# Altium schematic sheet Disconnects.SchDoc
size Tabloid; DocumentNumber: 2; SheetNumber: 2; SheetTotal: 2
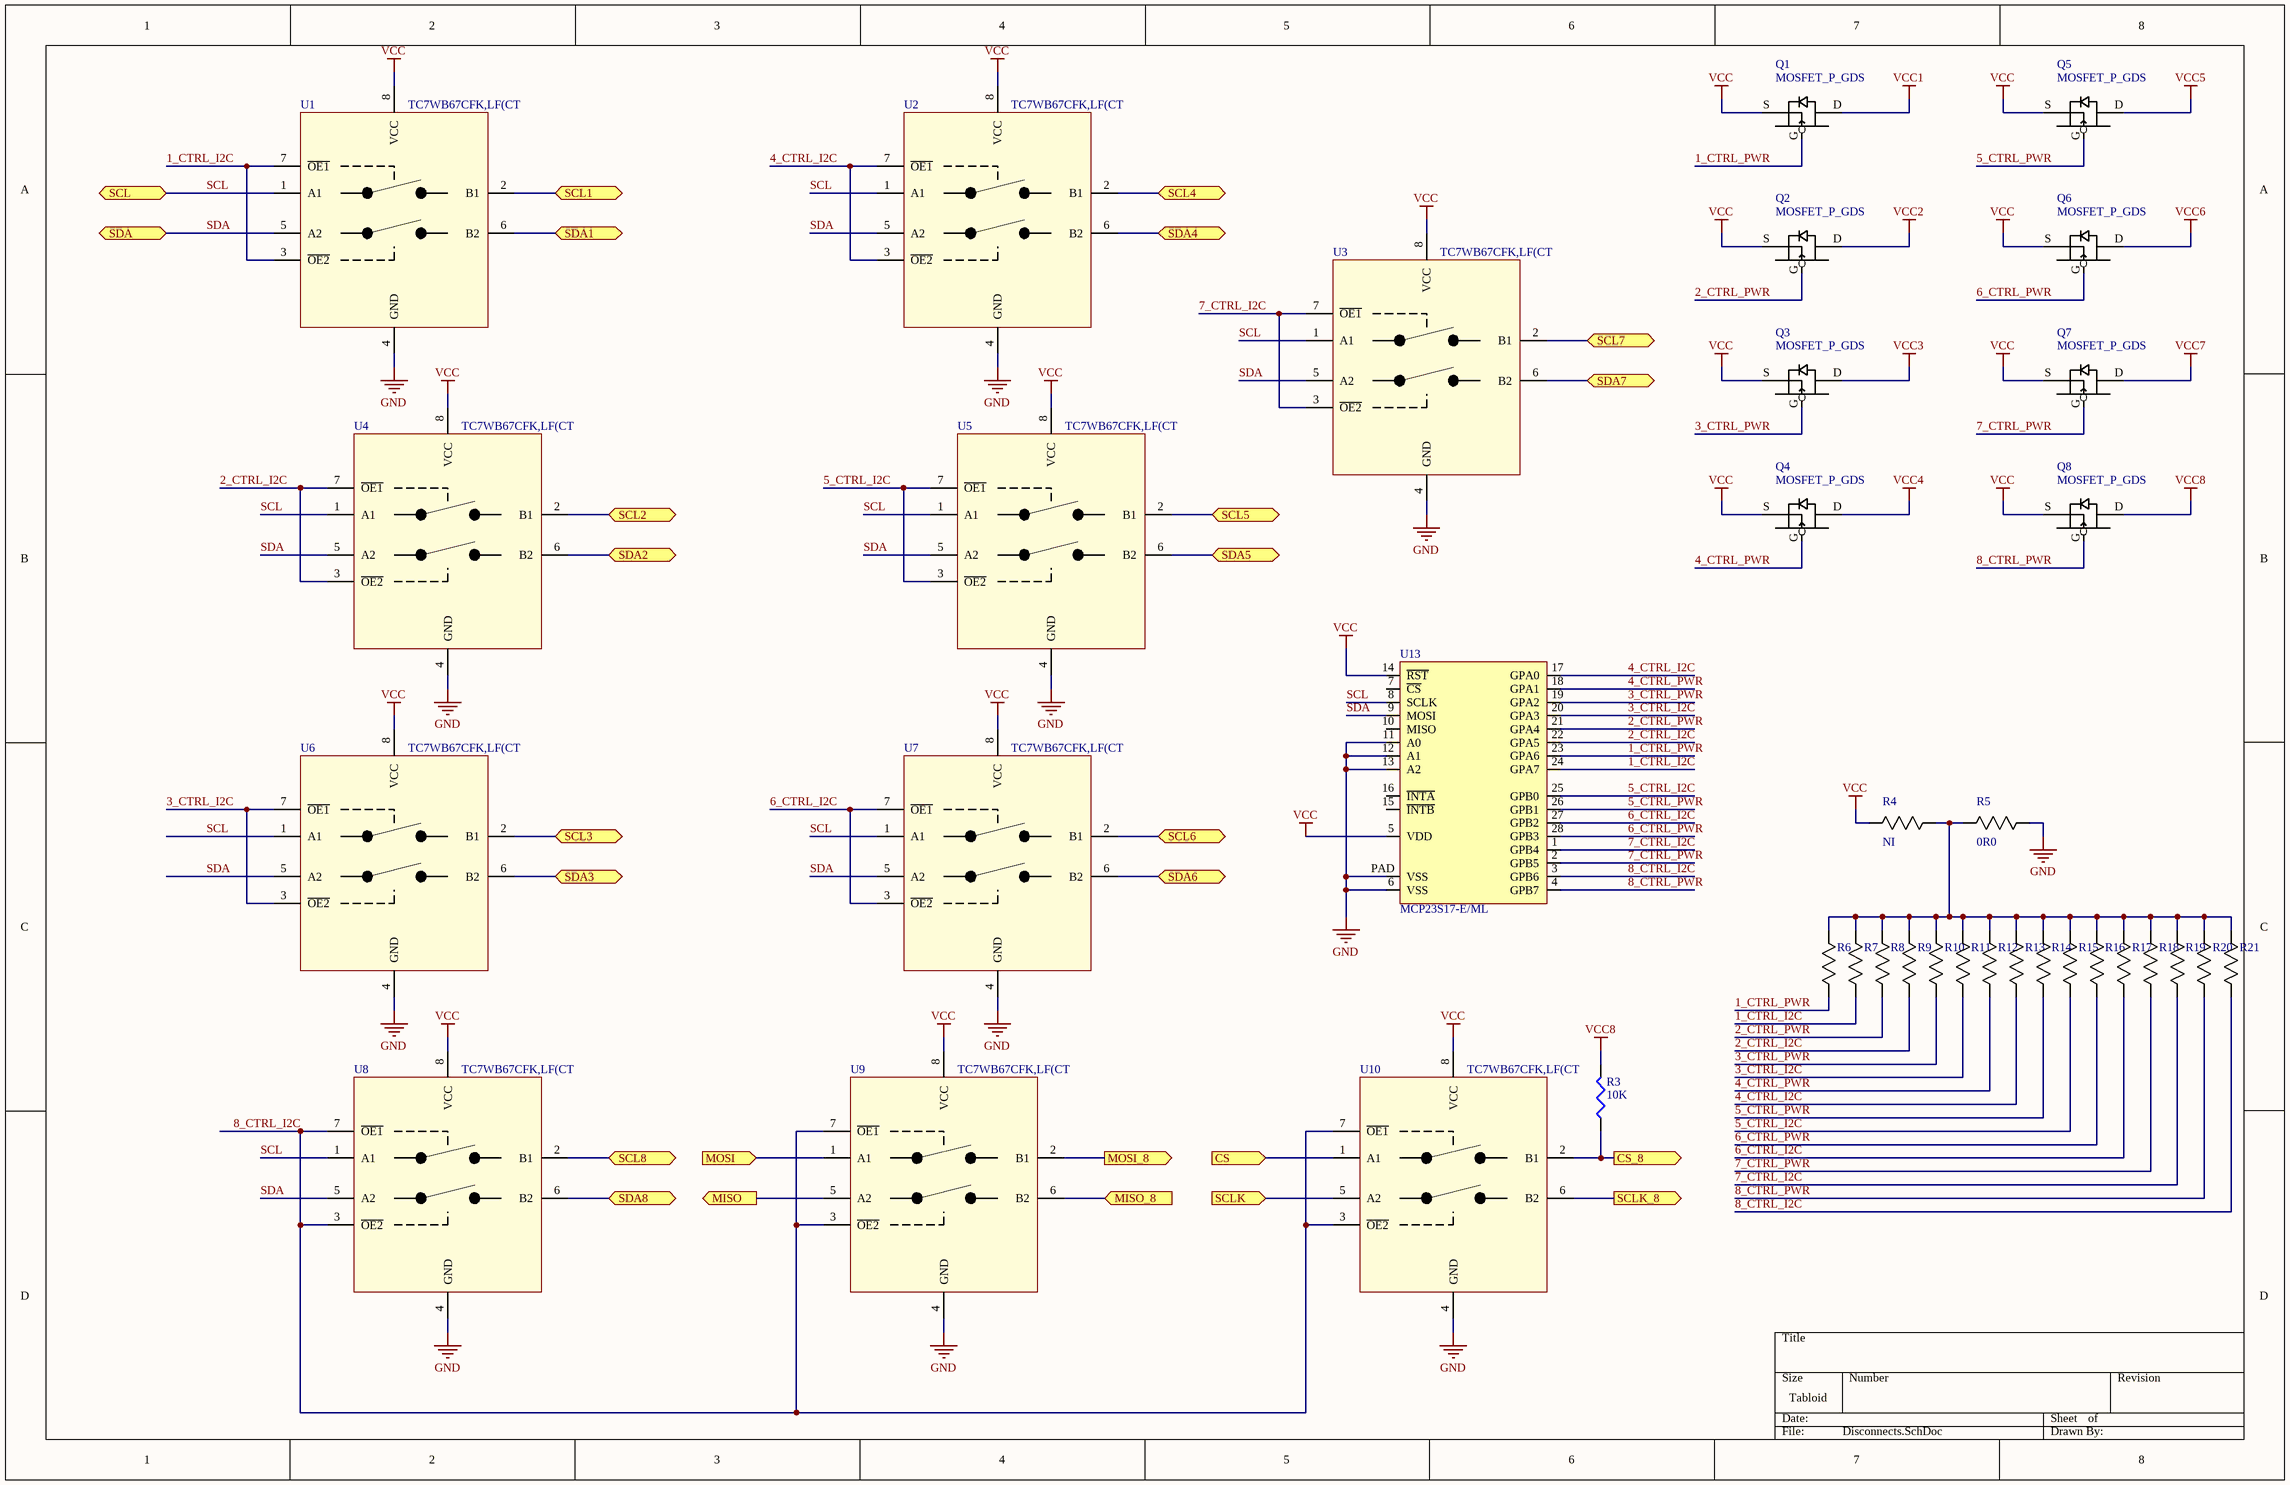
[diagram p0: Disconnects.SchDoc]

## Parts
Q1  MOSFET_P_GDS  [SC70_GDS]
Q2  MOSFET_P_GDS  [SC70_GDS]
Q3  MOSFET_P_GDS  [SC70_GDS]
Q4  MOSFET_P_GDS  [SC70_GDS]
Q5  MOSFET_P_GDS  [SC70_GDS]
Q6  MOSFET_P_GDS  [SC70_GDS]
Q7  MOSFET_P_GDS  [SC70_GDS]
Q8  MOSFET_P_GDS  [SC70_GDS]
R3  value 10K  [6-0805_N]  (hidden comment: Res 10K)
R4  Resistor  [0603]  (value not drawn)
R5  value 0R0  [0603]  (hidden comment: Resistor)
R6  Resistor  [0603]  (value not drawn)
R7  Resistor  [0603]  (value not drawn)
R8  Resistor  [0603]  (value not drawn)
R9  Resistor  [0603]  (value not drawn)
R10  Resistor  [0603]  (value not drawn)
R11  Resistor  [0603]  (value not drawn)
R12  Resistor  [0603]  (value not drawn)
R13  Resistor  [0603]  (value not drawn)
R14  Resistor  [0603]  (value not drawn)
R15  Resistor  [0603]  (value not drawn)
R16  Resistor  [0603]  (value not drawn)
R17  Resistor  [0603]  (value not drawn)
R18  Resistor  [0603]  (value not drawn)
R19  Resistor  [0603]  (value not drawn)
R20  Resistor  [0603]  (value not drawn)
R21  Resistor  [0603]  (value not drawn)
U1  Mfg_PN: TC7WB67CFK,LF(CT  [PSOP8]  (hidden comment: TC7WB67CFK,LF)
U2  Mfg_PN: TC7WB67CFK,LF(CT  [PSOP8]  (hidden comment: TC7WB67CFK,LF)
U3  Mfg_PN: TC7WB67CFK,LF(CT  [PSOP8]  (hidden comment: TC7WB67CFK,LF)
U4  Mfg_PN: TC7WB67CFK,LF(CT  [PSOP8]  (hidden comment: TC7WB67CFK,LF)
U5  Mfg_PN: TC7WB67CFK,LF(CT  [PSOP8]  (hidden comment: TC7WB67CFK,LF)
U6  Mfg_PN: TC7WB67CFK,LF(CT  [PSOP8]  (hidden comment: TC7WB67CFK,LF)
U7  Mfg_PN: TC7WB67CFK,LF(CT  [PSOP8]  (hidden comment: TC7WB67CFK,LF)
U8  Mfg_PN: TC7WB67CFK,LF(CT  [PSOP8]  (hidden comment: TC7WB67CFK,LF)
U9  Mfg_PN: TC7WB67CFK,LF(CT  [PSOP8]  (hidden comment: TC7WB67CFK,LF)
U10  Mfg_PN: TC7WB67CFK,LF(CT  [PSOP8]  (hidden comment: TC7WB67CFK,LF)
U13  MCP23S17-E/ML  [QFN28-S]

## Ports
CS (in), CS_8 (out), MISO (out), MISO_8 (in), MOSI (in), MOSI_8 (out), SCL1 (bidir), SCL2 (bidir), SCL3 (bidir), SCL4 (bidir), SCL5 (bidir), SCL6 (bidir), SCL7 (bidir), SCL8 (bidir), SCL (bidir), SCLK (in), SCLK_8 (out), SDA1 (bidir), SDA2 (bidir), SDA3 (bidir), SDA4 (bidir), SDA5 (bidir), SDA6 (bidir), SDA7 (bidir), SDA8 (bidir), SDA (bidir)

## Nets
GND: R5.2 U1.4(GND) U2.4(GND) U3.4(GND) U4.4(GND) U5.4(GND) U6.4(GND) U7.4(GND) U8.4(GND) U9.4(GND) U10.4(GND) U13.6(VSS) U13.11(A0) U13.12(A1) U13.13(A2) U13.PAD(VSS)
VCC: Q1.S Q2.S Q3.S Q4.S Q5.S Q6.S Q7.S Q8.S R4.1 U1.8(VCC) U2.8(VCC) U3.8(VCC) U4.8(VCC) U5.8(VCC) U6.8(VCC) U7.8(VCC) U8.8(VCC) U9.8(VCC) U10.8(VCC) U13.5(VDD) U13.14(~{RST})
VCC1: Q1.D
VCC2: Q2.D
VCC3: Q3.D
VCC4: Q4.D
VCC5: Q5.D
VCC6: Q6.D
VCC7: Q7.D
VCC8: Q8.D R3.2
1_CTRL_I2C: R7.2 U1.3(~{OE2}) U1.7(~{OE1}) U13.24(GPA7)
1_CTRL_PWR: Q1.G R6.2 U13.23(GPA6)
2_CTRL_I2C: R9.2 U4.3(~{OE2}) U4.7(~{OE1}) U13.22(GPA5)
2_CTRL_PWR: Q2.G R8.2 U13.21(GPA4)
3_CTRL_I2C: R11.2 U6.3(~{OE2}) U6.7(~{OE1}) U13.20(GPA3)
3_CTRL_PWR: Q3.G R10.2 U13.19(GPA2)
4_CTRL_I2C: R13.2 U2.3(~{OE2}) U2.7(~{OE1}) U13.17(GPA0)
4_CTRL_PWR: Q4.G R12.2 U13.18(GPA1)
5_CTRL_I2C: R15.2 U5.3(~{OE2}) U5.7(~{OE1}) U13.25(GPB0)
5_CTRL_PWR: Q5.G R14.2 U13.26(GPB1)
6_CTRL_I2C: R17.2 U7.3(~{OE2}) U7.7(~{OE1}) U13.27(GPB2)
6_CTRL_PWR: Q6.G R16.2 U13.28(GPB3)
7_CTRL_I2C: R19.2 U3.3(~{OE2}) U3.7(~{OE1}) U13.1(GPB4)
7_CTRL_PWR: Q7.G R18.2 U13.2(GPB5)
8_CTRL_I2C: R21.2 U8.3(~{OE2}) U8.7(~{OE1}) U9.3(~{OE2}) U9.7(~{OE1}) U10.3(~{OE2}) U10.7(~{OE1}) U13.3(GPB6)
8_CTRL_PWR: Q8.G R20.2 U13.4(GPB7)
CS: U10.1(A1) ; port CS
CS_8: R3.1 U10.2(B1) ; port CS_8
MISO: U9.5(A2) ; port MISO
MISO_8: U9.6(B2) ; port MISO_8
MOSI: U9.1(A1) ; port MOSI
MOSI_8: U9.2(B1) ; port MOSI_8
SCL: U1.1(A1) U2.1(A1) U3.1(A1) U4.1(A1) U5.1(A1) U6.1(A1) U7.1(A1) U8.1(A1) U13.8(SCLK) ; port SCL
SCL1: U1.2(B1) ; port SCL1
SCL2: U4.2(B1) ; port SCL2
SCL3: U6.2(B1) ; port SCL3
SCL4: U2.2(B1) ; port SCL4
SCL5: U5.2(B1) ; port SCL5
SCL6: U7.2(B1) ; port SCL6
SCL7: U3.2(B1) ; port SCL7
SCL8: U8.2(B1) ; port SCL8
SCLK: U10.5(A2) ; port SCLK
SCLK_8: U10.6(B2) ; port SCLK_8
SDA: U1.5(A2) U2.5(A2) U3.5(A2) U4.5(A2) U5.5(A2) U6.5(A2) U7.5(A2) U8.5(A2) U13.9(MOSI) ; port SDA
SDA1: U1.6(B2) ; port SDA1
SDA2: U4.6(B2) ; port SDA2
SDA3: U6.6(B2) ; port SDA3
SDA4: U2.6(B2) ; port SDA4
SDA5: U5.6(B2) ; port SDA5
SDA6: U7.6(B2) ; port SDA6
SDA7: U3.6(B2) ; port SDA7
SDA8: U8.6(B2) ; port SDA8
NetR4_2: R4.2 R5.1 R6.1 R7.1 R8.1 R9.1 R10.1 R11.1 R12.1 R13.1 R14.1 R15.1 R16.1 R17.1 R18.1 R19.1 R20.1 R21.1

Not connected (* = marked no-connect by the designer): U13 7(~{CS}) 10(MISO) 15(~{INTB}) 16(~{INTA})

## Library data of the parts
Q1-Q8 = MOSFET_P_GDS: PMOS; Mfg: OnSemi; Mfg_PN: NTS4101PT1G; HelpURL: *; NI: *; Rating: *; Supplier1: Digikey; Supplier1_PN: NTS4101PT1GOSCT-ND; Tolerance: *; Type: *; Value: *
R3 = Res 10K: Resistor 10K; Published: 8-Jun-2000; LatestRevisionDate: 29-May-2009; LatestRevisionNote: IPC-7351 Footprint Added.; PackageReference: J1-0603; Publisher: Altium Limited; PackageDescription: Chip Resistor; Supplier 1: Digi-Key; Supplier1_PN: 311-10.0KCRCT-ND
R4 R6-R21 = Resistor: Mfg: Bourns; Mfg_PN: CR0603-JW-104ELF; Value: 100k; HelpURL: *; Supplier1: Digikey; Supplier1_PN: CR0603-JW-104ELFCT-ND; Type: *; Rating: *; Tolerance: *
  R4: NI: NI
  R6-R21: NI: *
R5 = Resistor: Mfg: KOA; Mfg_PN: RK73Z1JTTD; HelpURL: *; NI: *; Supplier1: Digikey; Supplier1_PN: 2019-RK73Z1JTTDCT-ND; Type: *; Rating: *; Tolerance: *
U1-U10 = TC7WB67CFK,LF: Dual analog switch; Mfg: Toshiba; HelpURL: *; NI: *; Rating: *; Supplier1: Digikey; Supplier1_PN: TC7WB67CFKLF(CTCT-ND; Tolerance: *; Type: *; Value: *
U13 = MCP23S17-E/ML: 16-Bit SPI I/O Expander; Mfg: Microchip; Mfg_PN: MCP23017-E/ML; Supplier1: Digikey; Supplier1_PN: MCP23017-E/ML-ND